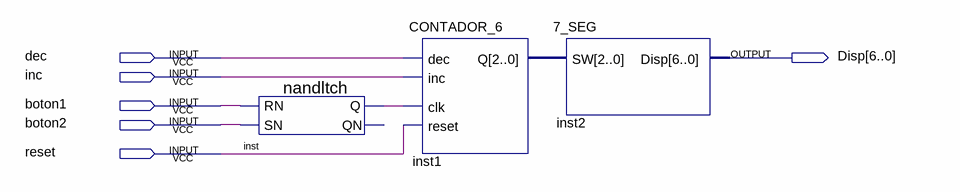
[diagram p0: schematic sheet]
// Quartus schematic TAREA2_B.bdf as structural Verilog: 3 symbols, 6 pins
module TAREA2_B (
  input  dec,
  input  inc,
  input  boton1,
  input  boton2,
  input  reset,
  output [6:0] Disp
);

  wire inst_q;
  wire [2:0] inst1_q;

  nandltch inst (.RN(boton1), .SN(boton2), .Q(inst_q));  // open: QN
  CONTADOR_6 inst1 (.dec(dec), .inc(inc), .clk(inst_q), .reset(reset), .Q(inst1_q));
  \7_SEG  inst2 (.SW(inst1_q), .Disp(Disp));
endmodule
